# Altium schematic sheet H-00491 - Top.SchDoc: Top Sheet
size 403 x 281 mm
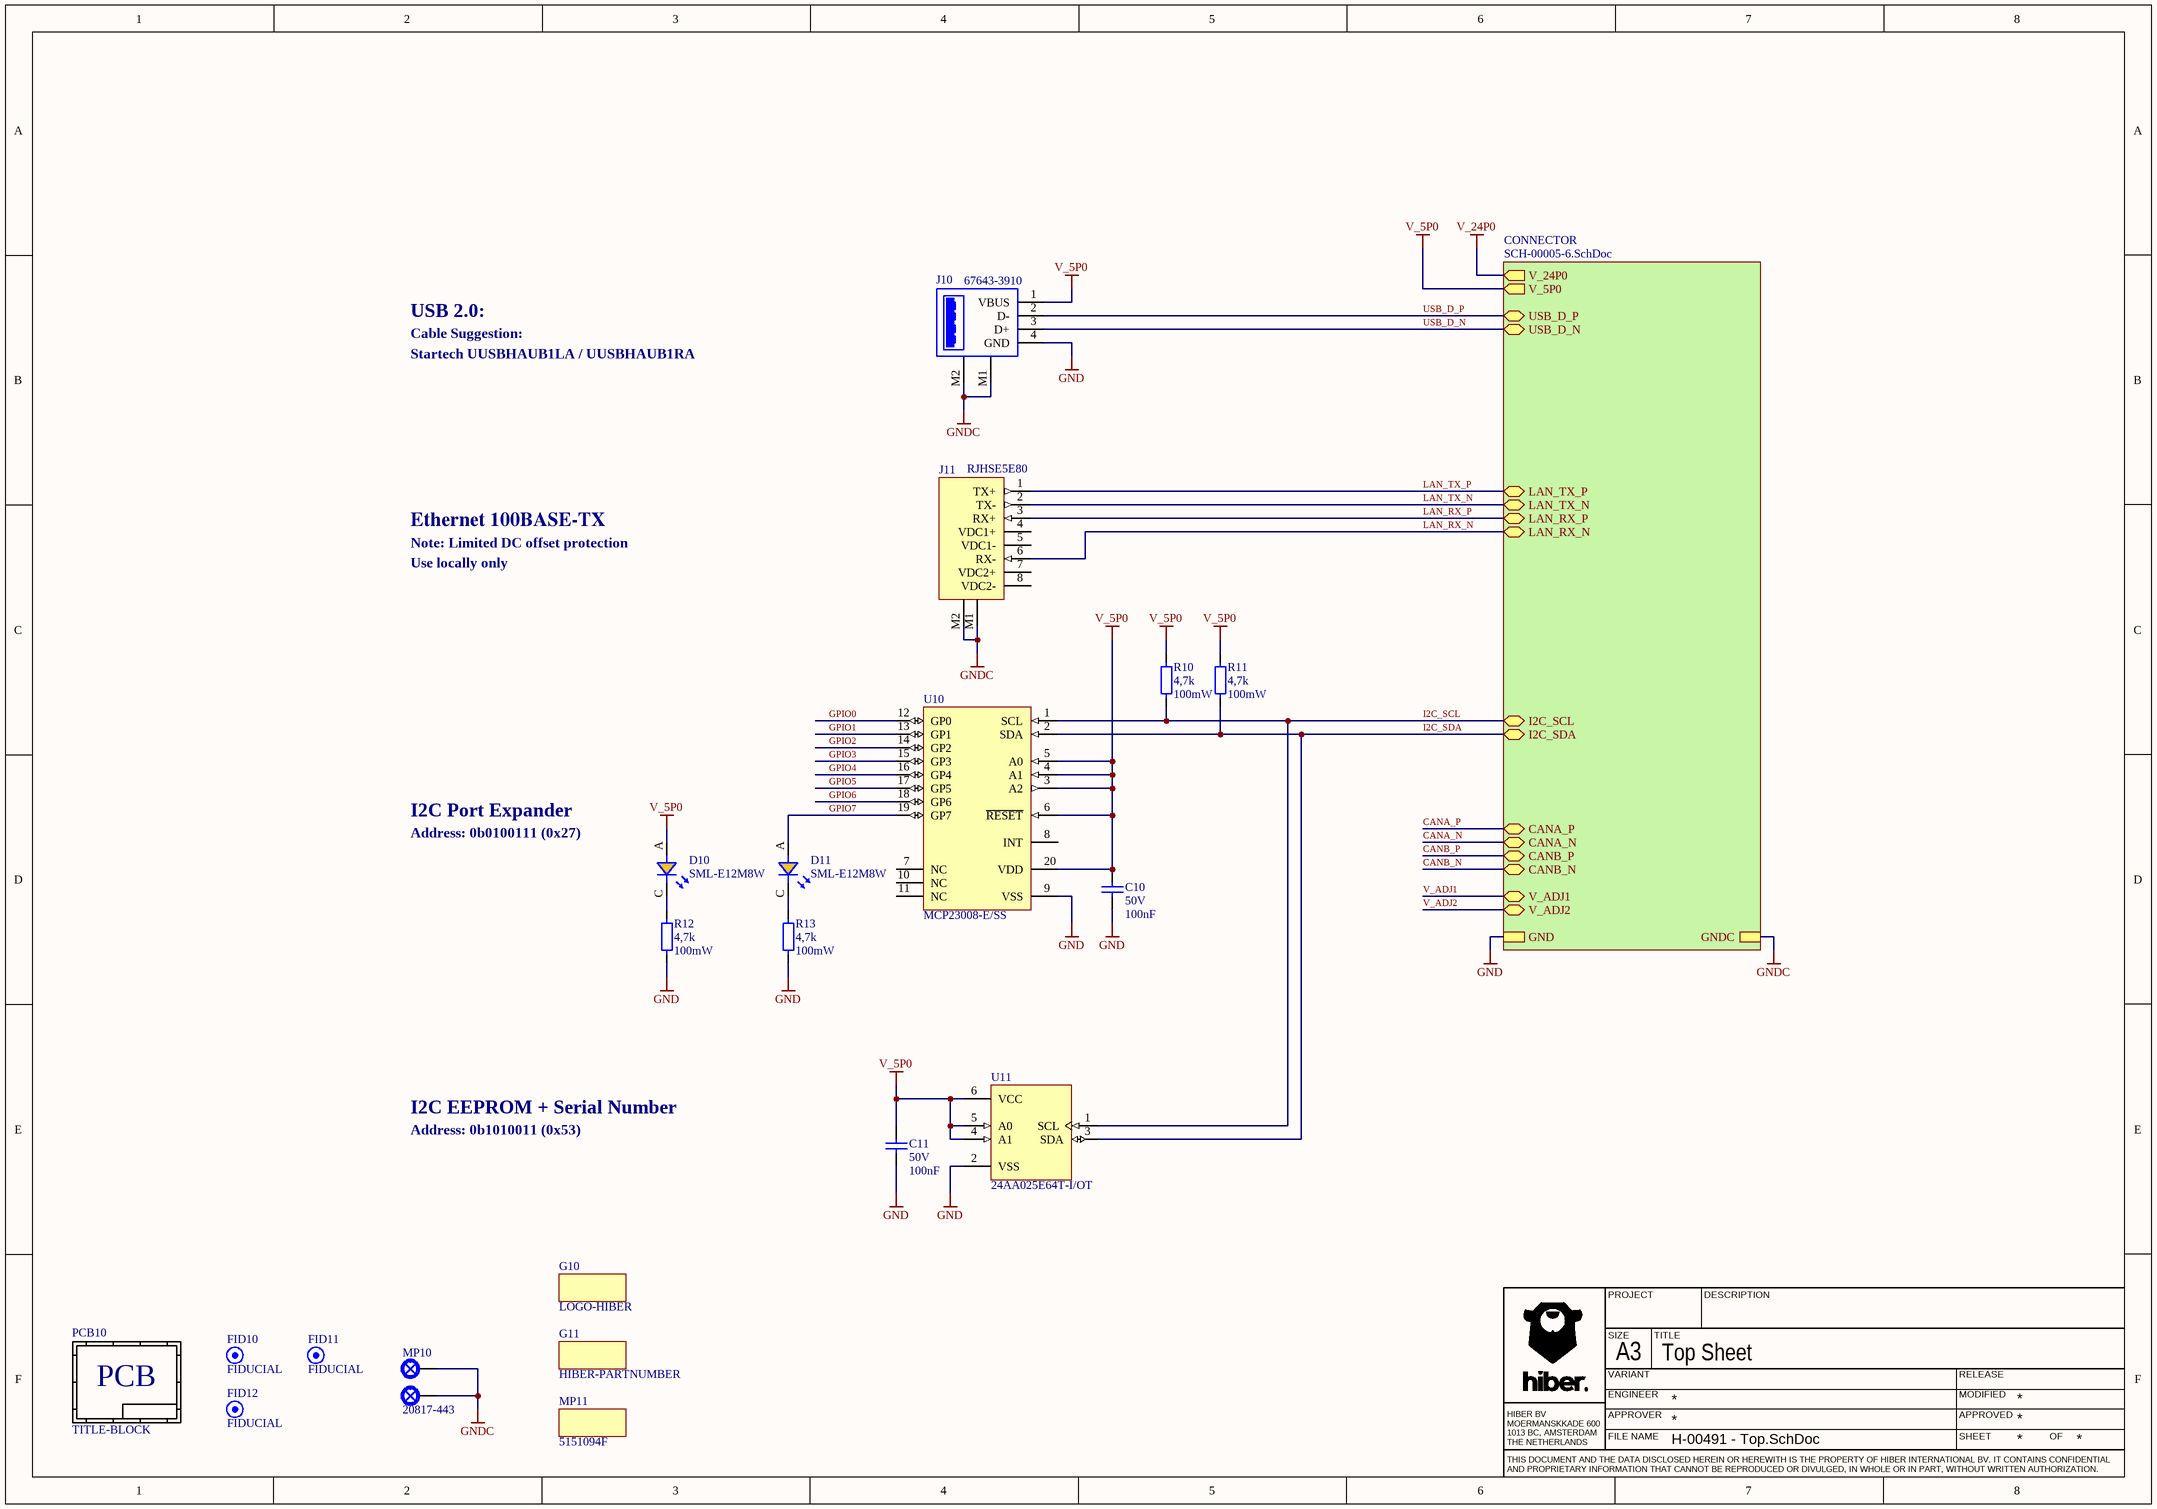
[diagram p0: H-00491 - Top.SchDoc]

## Parts
C10  value 100nF  Rated Voltage: 50V  [CAPC160X80X87L35N]  (hidden comment: C0603C104K5RACTU)
C11  value 100nF  Rated Voltage: 50V  [CAPC160X80X87L35N]  (hidden comment: C0603C104K5RACTU)
D10  SML-E12M8W  [LEDC170X80X80L20_YELLOW]
D11  SML-E12M8W  [LEDC170X80X80L20_YELLOW]
FID10  FIDUCIAL  [FIDUCIAL_075X150]  (no BOM)
FID11  FIDUCIAL  [FIDUCIAL_075X150]  (no BOM)
FID12  FIDUCIAL  [FIDUCIAL_075X150]  (no BOM)
G10  LOGO-HIBER  [HIBER_LOGO_COPPER_55x40]  (no BOM)
G11  HIBER-PARTNUMBER  [HIBER_PNSN_COPPER]  (no BOM)
J10  67643-3910  [MOLEX_676433910]
J11  RJHSE5E80  [AMPHENOLICC_RJHSE5E80]
MP10  20817-443  [SCHROFF_20817443]
MP11  5151094F  [DIALIGHT_5151094F]
PCB10  TITLE-BLOCK  [TITLEBLOCK-A4]
R10  value 4,7k  Rated Power: 100mW  [RESC160X85X55L30N]  (hidden comment: CRCW06034K70FKEA)
R11  value 4,7k  Rated Power: 100mW  [RESC160X85X55L30N]  (hidden comment: CRCW06034K70FKEA)
R12  value 4,7k  Rated Power: 100mW  [RESC160X85X55L30N]  (hidden comment: CRCW06034K70FKEA)
R13  value 4,7k  Rated Power: 100mW  [RESC160X85X55L30N]  (hidden comment: CRCW06034K70FKEA)
U10  MCP23008-E/SS  [SOP20P65_720X780X200L75X30N]
U11  24AA025E64T-I/OT  [SOT23-6P95_270X145L35X35]

## Sub-sheets
CONNECTOR = SCH-00005-6.SchDoc: LAN_TX_P (bidir), LAN_TX_N (bidir), LAN_RX_P (bidir), LAN_RX_N (bidir), USB_D_P (bidir), USB_D_N (bidir), I2C_SCL (bidir), I2C_SDA (bidir), V_ADJ1 (bidir), V_ADJ2 (bidir), V_5P0 (out), V_24P0 (out), GND, CANA_P (bidir), CANA_N (bidir), CANB_P (bidir), CANB_N (bidir), GNDC

## Nets
GND: C10.2 C11.2 J10.4(GND) R12.2 R13.2 U10.9(VSS) U11.2(VSS) ; sheet CONNECTOR/GND
GNDC: J10.M1(SHLD1) J10.M2(SHLD2) J11.M1(SHLD) J11.M2(SHLD) MP10.M1 MP10.M2 ; sheet CONNECTOR/GNDC
V_5P0: C10.1 C11.1 D10.A J10.1(VBUS) R10.1 R11.1 U10.3(A2) U10.4(A1) U10.5(A0) U10.6(~{RESET}) U10.20(VDD) U11.4(A1) U11.5(A0) U11.6(VCC) ; sheet CONNECTOR/V_5P0
V_24P0: sheet CONNECTOR/V_24P0
CANA_N: sheet CONNECTOR/CANA_N
CANA_P: sheet CONNECTOR/CANA_P
CANB_N: sheet CONNECTOR/CANB_N
CANB_P: sheet CONNECTOR/CANB_P
GPIO0: U10.12(GP0)
GPIO1: U10.13(GP1)
GPIO2: U10.14(GP2)
GPIO3: U10.15(GP3)
GPIO4: U10.16(GP4)
GPIO5: U10.17(GP5)
GPIO6: U10.18(GP6)
GPIO7: D11.A U10.19(GP7)
I2C_SCL: R10.2 U10.1(SCL) U11.1(SCL) ; sheet CONNECTOR/I2C_SCL
I2C_SDA: R11.2 U10.2(SDA) U11.3(SDA) ; sheet CONNECTOR/I2C_SDA
LAN_RX_N: J11.6(RX-) ; sheet CONNECTOR/LAN_RX_N
LAN_RX_P: J11.3(RX+) ; sheet CONNECTOR/LAN_RX_P
LAN_TX_N: J11.2(TX-) ; sheet CONNECTOR/LAN_TX_N
LAN_TX_P: J11.1(TX+) ; sheet CONNECTOR/LAN_TX_P
USB_D_N: J10.3(D+) ; sheet CONNECTOR/USB_D_N
USB_D_P: J10.2(D-) ; sheet CONNECTOR/USB_D_P
V_ADJ1: sheet CONNECTOR/V_ADJ1
V_ADJ2: sheet CONNECTOR/V_ADJ2
NetD10_C: D10.C R12.1
NetD11_C: D11.C R13.1

Not connected (* = marked no-connect by the designer): J11 4(VDC1+) 5(VDC1-) 7(VDC2+) 8(VDC2-); U10 7(NC) 8(INT) 10(NC) 11(NC)

## Notes on the sheet
- USB 2.0:
- Startech UUSBHAUB1LA / UUSBHAUB1RA
- Cable Suggestion:
- Ethernet 100BASE-TX
- Note: Limited DC offset protection
- Use locally only
- I2C Port Expander
- Address: 0b0100111 (0x27)
- I2C EEPROM + Serial Number
- Address: 0b1010011 (0x53)
- PROJECT
- DESCRIPTION
- SIZE
- ENGINEER
- VARIANT
- A3
- TITLE
- MODIFIED
- RELEASE
- HIBER BV
  MOERMANSKKADE 600
  1013 BC, AMSTERDAM
  THE NETHERLANDS
- FILE NAME
- APPROVER
- SHEET
- APPROVED
- OF
- THIS DOCUMENT AND THE DATA DISCLOSED HEREIN OR HEREWITH IS THE PROPERTY OF HIBER INTERNATIONAL BV. IT CONTAINS CONFIDENTIAL AND PROPRIETARY INFORMATION THAT CANNOT BE REPRODUCED OR DIVULGED, IN WHOLE OR IN PART, WITHOUT WRITTEN AUTHORIZATION.
- (in symbol CMP-00011-3) PCB

## Library data of the parts
C10 C11 = CMP-00418-1: CAP Standard 0603 (1608) 100,0nF 50V X7R (Standard); Type: Ceramic; Tolerance: 10%; Termination Finish: 100% Matte Sn; Qualification: Standard; RoHS: Yes; Mount: Surface Mount; Case/Package: 0603 (1608); Failure Rate: N/A; Pins: 2; Dielectric: X7R
D10 D11 = CMP-00429-1: LED Yellowish green Diffused 0603 SMD; Dominant Wavelength: 630nm; Forward Voltage: 2,4V; Typical Wavelength: 572nm; Viewing Angle: 140°; Chip Structure: AlGaInP; Number of LEDs: 1; Illumination Colour: Red; Lens Colour: White; Forward Current: 20mA; Luminous Intensity: 25mcd; Lens Style: Clear, Colorless, Diffused, Rectangular; Lens Transparency: Diffused; Min Operating Temperature: -40°C; Height: 0.46mm; Number of Pins: 2; Length: 1.6mm; Color: Yellowish green; Packaging: Tape and Reel; Case Code (Metric): 1608; Width: 0.8mm; Case/Package: 0603; Max Operating Temperature: 85°C; Radiation Hardening: No; Wavelength: 630nm; Package Quantity: 1; Lead Free: Lead Free; Case Code (Imperial): 0603; Mount: Surface Mount; Test Current: 20mA
FID10-FID12 = CMP-00519-1
G10 = CMP-00553-6: Hiber Logo
G11 = CMP-00558-6: Hiber Fabrication Partnumber
J10 = CMP-01203-2: USB Connector, 4 Contact(s), Female, Right Angle, Solder Terminal, Locking, Receptacle; Contact Resistance: 30m; Mount: Board; RoHS: Yes
J11 = CMP-00838-3: Modular Connectors / Ethernet Connectors High Speed RJ w/no LEDs or Shield; Direction: Up; Pitch: 2.03mm; Voltage Rating: 125V; Number of Contacts: 8; Current Rating: 1.5A; Shielding: Shielded; Connector Type: Jack; Insulation Resistance: 500MR; Gender: Female; Number of Ports: 1; Termination: Solder; Min Operating Temperature: -55°C; Contact Plating: Gold; Flammability Rating: UL94 V-0; Packaging: Tray; RoHS: Yes; Mount: Through Hole; Orientation: Right Angle; Package Quantity: 120; Number of Rows: 1; Max Operating Temperature: 85°C; Number of Positions: 8; Contact Material: Bronze; Color: Black; Housing Material: Thermoplastic
MP10 = CMP-01152-2: SCHROFF         20817-443             MODULE, PLUG-IN, 3U, 4HP
MP11 = CMP-01206-1: Optical Pipe; REACH SVHC: Yes; Optoelectronic Device Type: OPTICAL PIPE; RoHS Compliant: Yes
PCB10 = CMP-00011-3: Title Block and PCB BOM Line Item
R10-R13 = CMP-00113-4: RES Standard Thick Film 0603 4K70 ±1% 0,1W; Qualification: Automotive; Rated Voltage: 75V; Case/Package: 0603 (1608); Pins: 2; RoHS: Yes; Mount: Surface Mount; Tolerance: 1%; Termination Finish: Pure tin solder contacts on Ni barrier layer; Failure Rate: N/A; Type: Standard Thick Film
U10 = CMP-01204-1: Parallel I/O Port, 8-Bit, 8 I/O, CMOS, PDSO20
U11 = CMP-01106-2: EEPROM, 256X8, Serial, CMOS, PDSO5; Time @ Peak Reflow Temperature-Max (s): 40s; Serial Bus Type: I2C; Terminal Finish: Tin; Peak Reflow Temperature (Cel): 260°C; Memory Type: EEPROM; Moisture Sensitivity Level: 1; JESD-609 Code: e3